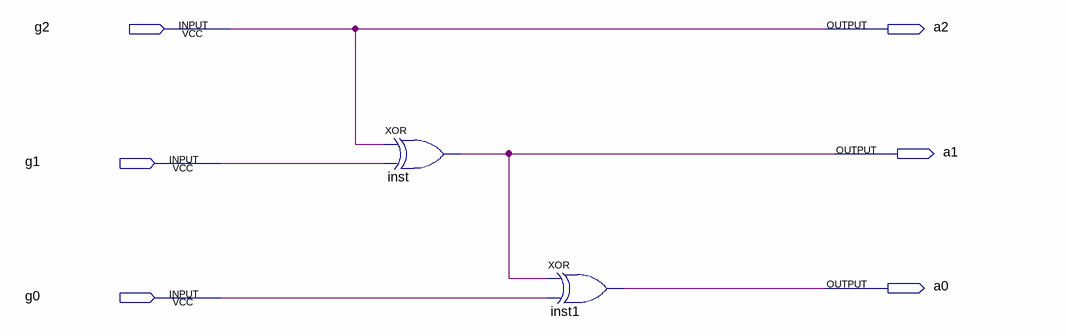
[diagram p0: schematic sheet]
// Quartus schematic q2.bdf as structural Verilog: 2 symbols, 6 pins
module q2 (
  input  g2,
  input  g1,
  input  g0,
  output a2,
  output a1,
  output a0
);

  xor inst (a1, g2, g1);
  xor inst1 (a0, a1, g0);

  assign a2 = g2;
endmodule
